# EAGLE design Skematik FC (EAGLE 9.6.2)
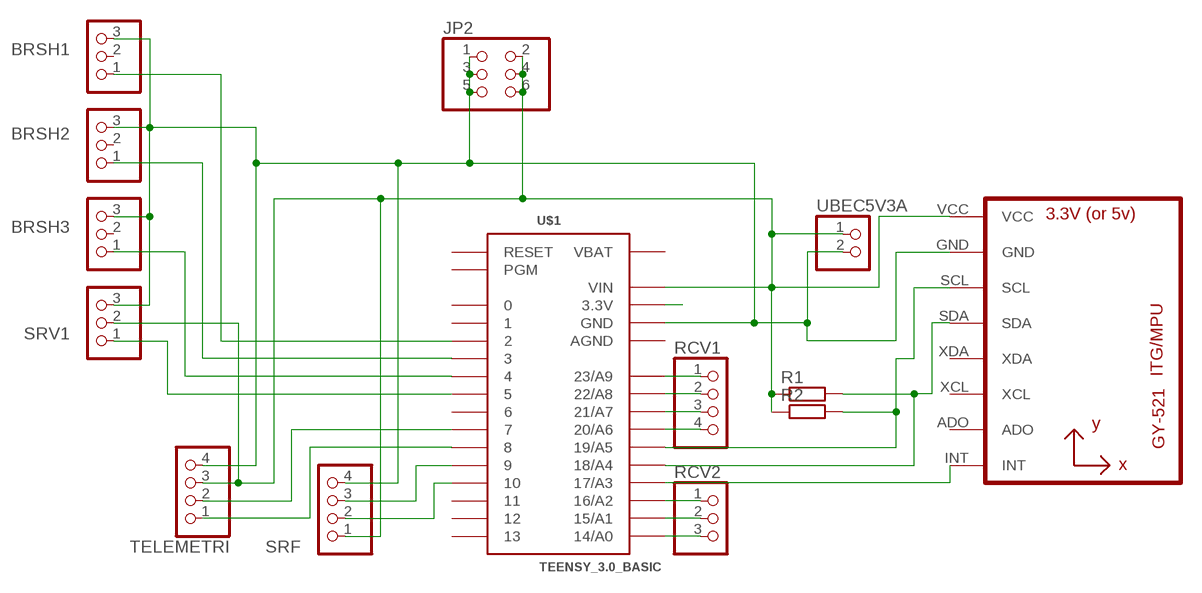
[diagram p0: schematic, sheet 1]

## Parts
BRSH1  PINHD-1X3  [1X03]
BRSH3  PINHD-1X3  [1X03]
BRSHL2  BRSH2  PINHD-1X3  [1X03]
JP2  PINHD-2X3  [2X03]
R1  R-EU_0207/7  [0207/7]
R2  R-EU_0207/7  [0207/7]
RCV1  PINHD-1X4  [1X04]
RCV2  PINHD-1X3  [1X03]
SRF  PINHD-1X4  [1X04]
SRV1  PINHD-1X3  [1X03]
TELEMETRI  PINHD-1X4  [1X04]
U1  GY-521MPU6050  [GY-521]
U$1  TEENSY_3.0_BASIC  [TEENSY_3.0_BASIC]
UBEC5V3A  PINHD-1X2  [1X02]

## Nets
N$1: TELEMETRI.1 U$1.8
N$3: R2.2 U1.SCL U$1.19/A5
N$4: R1.2 U1.SDA U$1.18/A4
N$5: U1.INT U$1.17/A3
N$6: BRSHL2.1 U$1.3
N$7: TELEMETRI.2 U$1.7
N$8: BRSH1.1 U$1.2
N$9: BRSH3.1 U$1.4
N$11: SRV1.1 U$1.5
N$13: RCV1.1 U$1.23/A9
N$14: RCV1.2 U$1.22/A8
N$15: RCV1.3 U$1.21/A7
N$16: RCV1.4 U$1.20/A6
N$17: RCV2.1 U$1.16/A2
N$18: RCV2.2 U$1.15/A1
N$19: RCV2.3 U$1.14/A0
N$20: SRF.3 U$1.9
N$21: SRF.2 U$1.10
N$23: BRSH1.3 BRSH3.3 BRSHL2.3 JP2.1 JP2.3 JP2.5 SRF.4 SRV1.3 TELEMETRI.4 U1.GND U$1.GND U$1.GND1(GND) UBEC5V3A.2
N$24: JP2.2 JP2.4 JP2.6 R1.1 R2.1 SRF.1 SRV1.2 TELEMETRI.3 U1.VCC U$1.VIN UBEC5V3A.1
N$25: U$1.3.3V U$1.3.3V1(3.3V)
Unconnected: BRSH1.2 BRSH3.2 BRSHL2.2 U1.ADO U1.XCL U1.XDA U$1.0 U$1.1 U$1.6 U$1.11 U$1.12 U$1.13 U$1.PGM U$1.RESET

## Power pins joined to a net without a drawn wire
AGND: U$1.AGND
VBAT: U$1.VBAT

## Library data of the parts
BRSH1 BRSH3 BRSHL2 RCV2 SRV1 = pinhead:PINHD-1X3: PIN HEADER
JP2 = pinhead:PINHD-2X3: PIN HEADER
R1 R2 = rcl:R-EU_: RESISTOR, European symbol; SPICEPREFIX: R
RCV1 SRF TELEMETRI = pinhead:PINHD-1X4: PIN HEADER
U1 = gy-521:GY-521
U$1 = Teensy_3_Series_Board_v1.0:TEENSY_3.0_BASIC: Basic Teensy 3.0 with none of the 'inner' pins enabled. See '+4', 'AllAnalogPins", and 'AllPins' packages for additional pin holes, as needed.
UBEC5V3A = pinhead:PINHD-1X2: PIN HEADER

## Board
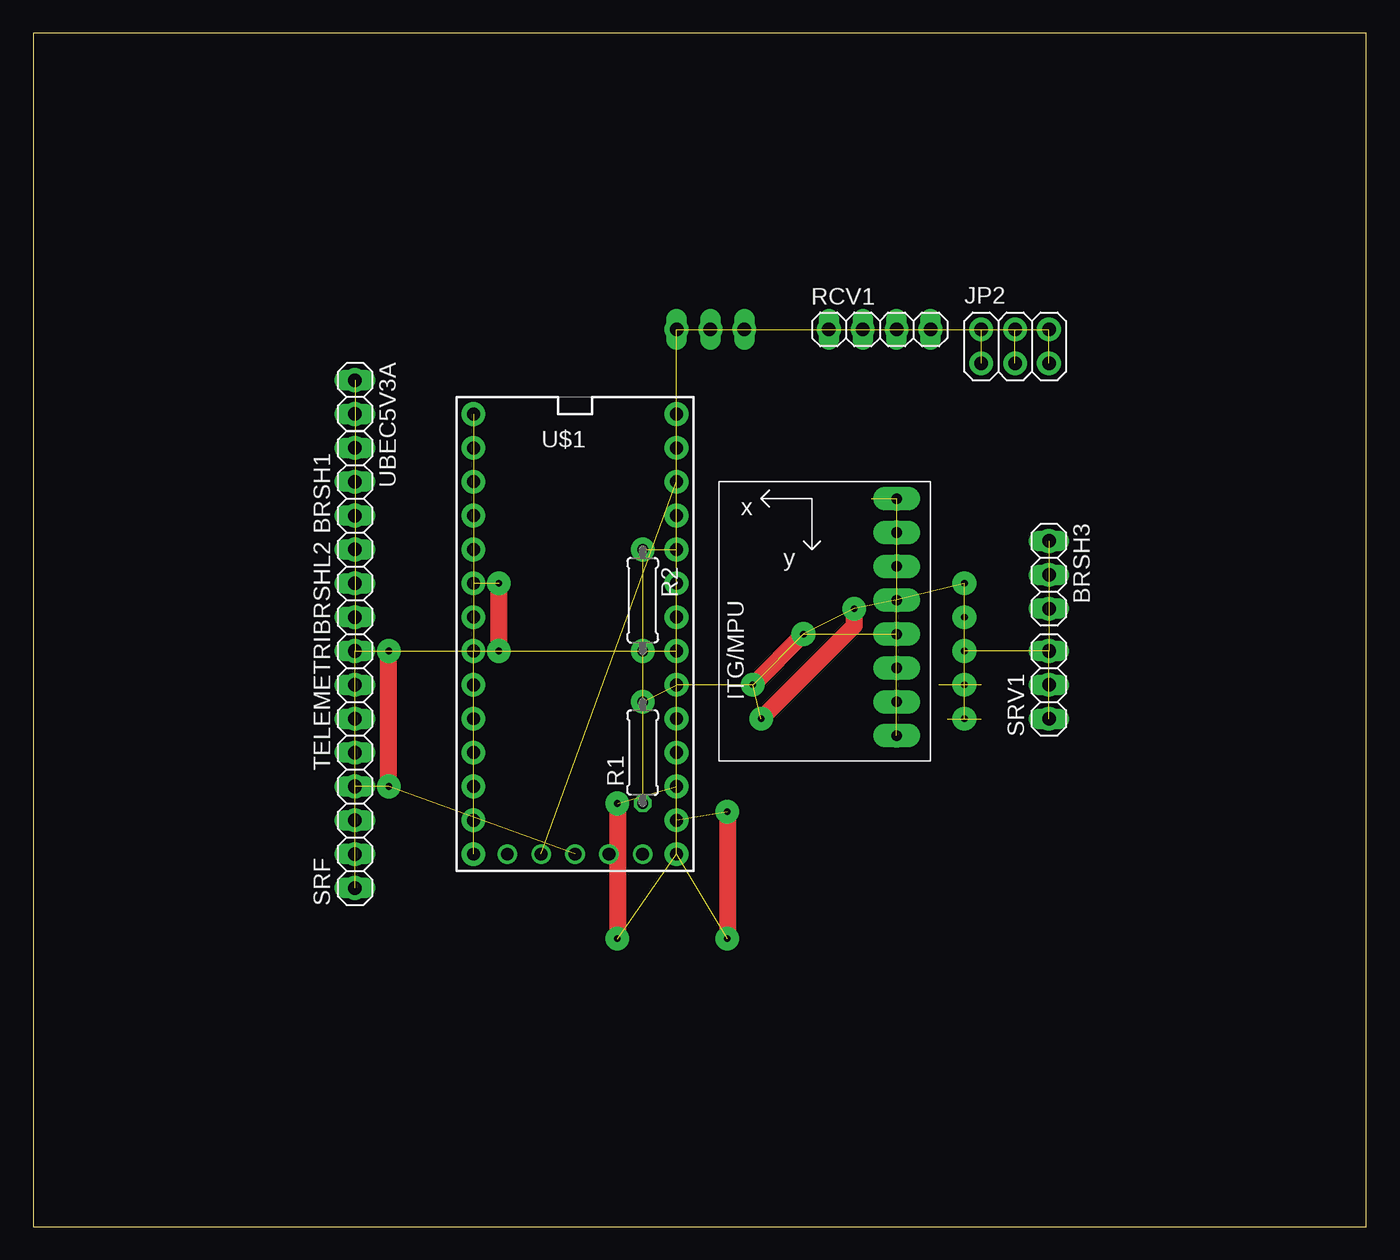
[diagram p1: board, top side]
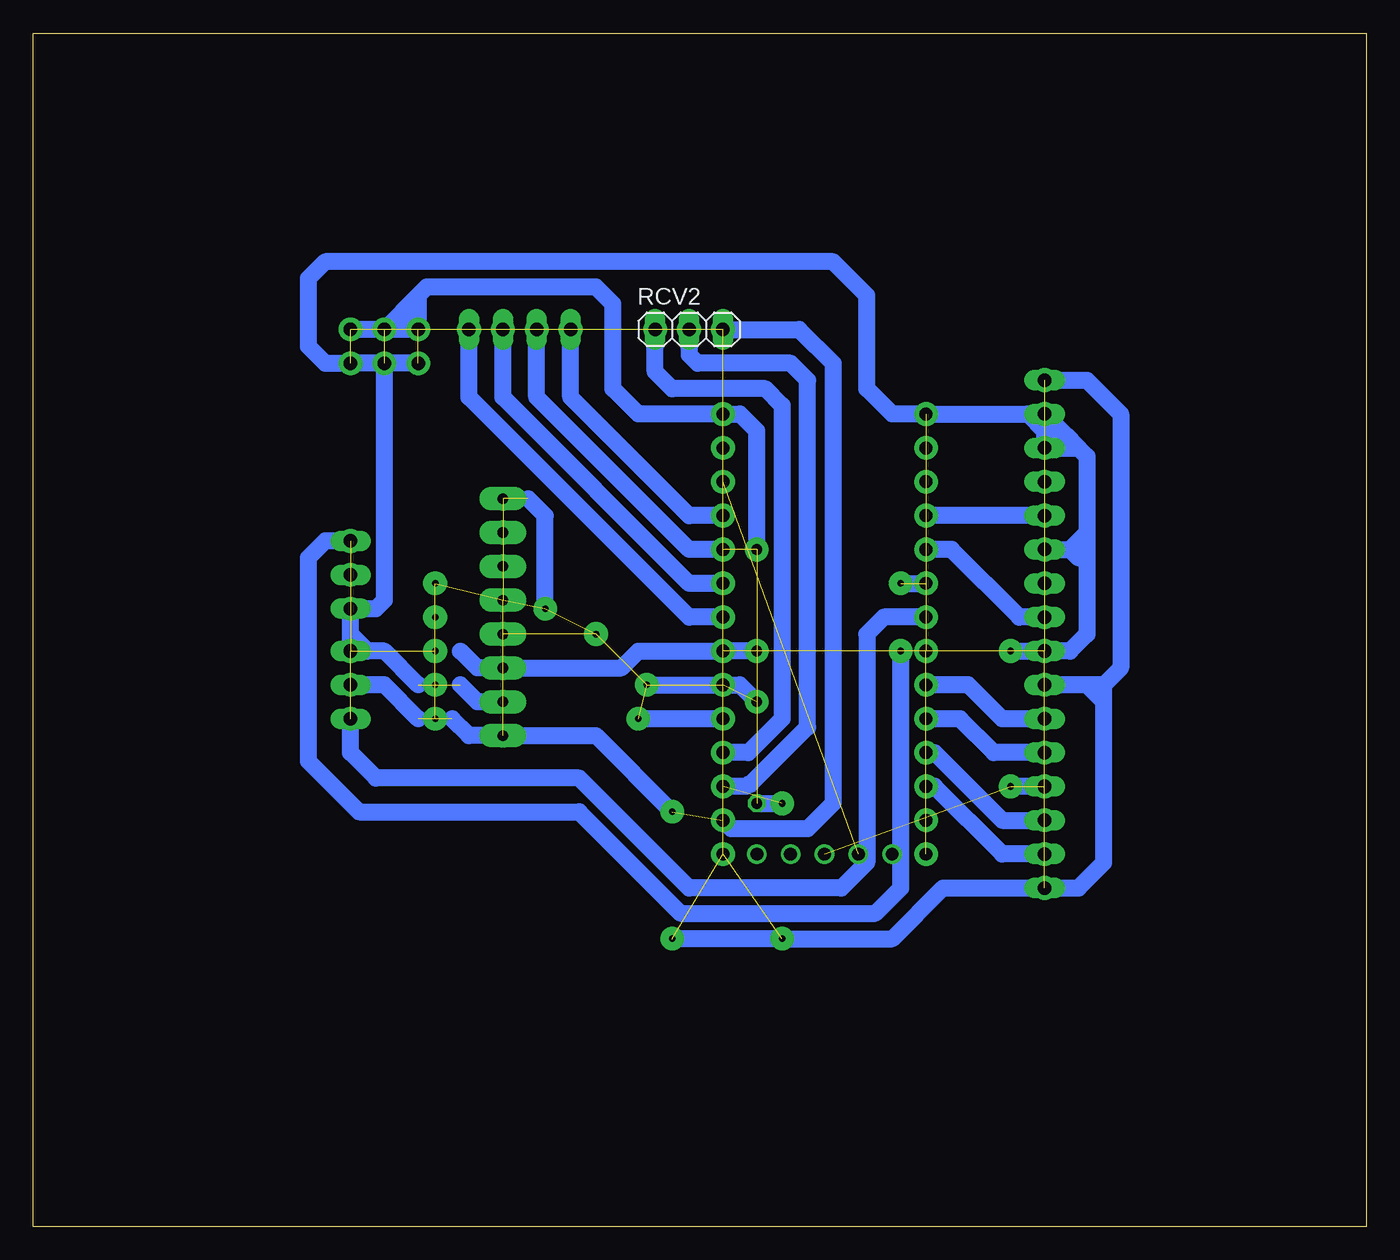
[diagram p2: board, bottom side, seen from below]

Size 100 x 89.53 mm. Coordinates in mm from the lower left corner, seen from the top.
Outline: 0,0 100,0 100,89.53 0,89.53 0,0
Copper layers (1*16): Top 0.035mm / dielectric 1.5mm / Bottom 0.035mm
Design rules "default": minimum track width 6mil, minimum drill 0.35mm, track to track 6mil, track to pad 6mil, pad to pad 6mil, via to via 6mil, smd to smd 6mil, copper to edge 40mil, drill to drill 6mil, minimum pad ring 10mil, minimum via ring 8mil, stop-mask expansion 4mil, vias tented up to drill 0mil, thermal gap 10mil

### Footprints (pad centres in the part's own frame; a part is rotated, then mirrored left to right if it is on the bottom)
1X03 = drill 1.016 long: 1 -2.54,0; 2 0,0; 3 2.54,0
2X03 = drill 1.016 octagon: 1 -2.54,-1.27; 2 -2.54,1.27; 3 0,-1.27; 4 0,1.27; 5 2.54,-1.27; 6 2.54,1.27
0207/7 = drill 0.813 octagon: 1 -3.81,0; 2 3.81,0
1X04 = drill 1.016 long: 1 -3.81,0; 2 -1.27,0; 3 1.27,0; 4 3.81,0
GY-521 = drill 0.8 pad 1.778 long: ADO -8.89,-6.35; GND -8.89,6.35; INT -8.89,-8.89; SCL -8.89,3.81; SDA -8.89,1.27; VCC -8.89,8.89; XCL -8.89,-3.81; XDA -8.89,-1.27
TEENSY_3.0_BASIC = drill 0.965: 0 -7.62,13.97; 1 -7.62,11.43; 2 -7.62,8.89; 3 -7.62,6.35; 3.3V 7.62,11.43; 3.3V1 -2.54,-16.51; 4 -7.62,3.81; 5 -7.62,1.27; 6 -7.62,-1.27; 7 -7.62,-3.81; 8 -7.62,-6.35; 9 -7.62,-8.89; 10 -7.62,-11.43; 11 -7.62,-13.97; 12 -7.62,-16.51; 13 7.62,-16.51; 14/A0 7.62,-13.97; 15/A1 7.62,-11.43; 16/A2 7.62,-8.89; 17/A3 7.62,-6.35; 18/A4 7.62,-3.81; 19/A5 7.62,-1.27; 20/A6 7.62,1.27; 21/A7 7.62,3.81; 22/A8 7.62,6.35; 23/A9 7.62,8.89; AGND 7.62,13.97; GND -7.62,16.51; GND1 0,-16.51; PGM 2.54,-16.51; RESET 5.08,-16.51; VBAT -5.08,-16.51; VIN 7.62,16.51
1X02 = drill 1.016 long: 1 -1.27,0; 2 1.27,0

### Placement (x,y rotation side)
BRSH1  24.13,55.88 90 top
BRSH3  76.2,48.9 270 top
BRSHL2  24.13,48.26 90 top
JP2  73.66,66.04 0 top
R1  45.72,35.56 90 top
R2  45.72,46.99 270 top
RCV1  63.5,67.31 0 top
RCV2  50.8,67.31 0 bottom
SRF  24.13,29.21 90 top
SRV1  76.2,40.64 90 top
TELEMETRI  24.13,39.37 90 top
U1  55.88,45.72 180 top
U$1  40.64,44.45 0 top
UBEC5V3A  24.13,62.23 270 top

### Tracks (layer width: path | path; a pad name or v marks a point on that pad's centre or on a via)
N$1
  Bottom 1.27: TELEMETRI.1 27.94,35.56 30.48,38.1 U$1.8
N$2  (via drill 0.5 pad 1.78)  (90 unrouted)
  other vias: 33.02,60.96 33.02,58.42 33.02,55.88 33.02,53.34 33.02,50.8 33.02,48.26 34.92,48.26 33.02,45.72 33.02,45.72 33.02,43.18 33.02,43.18 33.02,40.64 33.02,38.1 33.02,35.56 33.02,33.02 33.02,30.48 33.02,30.48 33.02,27.94 33.02,27.94 48.26,27.94 48.26,27.94 48.26,30.48 48.26,33.02 48.26,35.56 48.26,38.1 48.26,40.64 48.26,43.18 48.26,45.72 48.26,45.72 48.26,48.26 48.26,50.8 48.26,53.34 48.26,55.88 48.26,55.88 48.26,58.42 48.26,58.42 48.26,60.96 34.92,43.18 43.81,31.75 26.67,43.18 26.67,33.02 43.81,21.59 52.07,21.59 52.07,31.11 54.61,38.1 53.98,40.64 57.78,44.45 61.59,46.35 71.12,67.31 73.66,67.31 76.2,67.31 76.2,67.31 76.2,64.77 73.66,64.77 71.12,64.77 45.72,39.37 45.72,43.18 45.72,50.8 24.13,33.02 24.13,35.56 24.13,38.1 24.13,40.64 24.13,43.18 24.13,45.72 24.13,48.26 24.13,50.8 24.13,53.34 24.13,55.88 24.13,58.42 24.13,58.42 24.13,60.96 24.13,63.5 24.13,30.48 24.13,27.94 24.13,25.4 64.77,54.61 64.77,52.07 64.77,52.07 64.77,49.53 64.77,49.53 64.77,46.99 64.77,46.99 64.77,44.45 64.77,41.91 64.77,39.37 64.77,36.83 69.85,38.1 69.85,40.64 69.85,43.18 69.85,45.72 69.85,48.26 69.85,48.26 76.2,51.44 76.2,48.9 76.2,46.35 76.2,43.18 76.2,40.64 76.2,38.1 76.2,38.1 67.31,67.31 64.77,67.31 64.77,67.31 62.23,67.31 59.69,67.31 53.34,67.31 50.8,67.31 48.26,67.31
N$3
  Bottom 1.27: 67.94,43.18 66.67,41.91 U1.SCL 55.88,41.91 54.61,43.18 U$1.19/A5 R2.2
N$4  (via drill 0.35)  (1 unrouted)
  Top 1.27: v57.78,44.45 v53.98,40.64
  Bottom 1.27: U$1.18/A4 46.99,40.64 R1.2 | U$1.18/A4 v53.98,40.64 U$1.18/A4
N$5  (via drill 0.35)  (1 unrouted)
  Top 1.27: v54.61,38.1 61.59,45.09 v61.59,46.35
  Bottom 1.27: U$1.17/A3 v54.61,38.1 | v61.59,46.35 61.59,53.34 62.87,54.61
N$6
  Bottom 1.27: BRSHL2.1 26.04,45.72 31.11,50.8 U$1.3
N$7
  Bottom 1.27: TELEMETRI.2 27.3,38.1 29.84,40.64 U$1.7
N$8
  Bottom 1.27: BRSH1.1 U$1.2
N$9  (via drill 0.35)
  Top 1.27: v34.92,43.18 v34.92,48.26
  Bottom 1.27: BRSH3.1 78.11,51.44 79.38,50.16 79.38,34.92 75.56,31.11 59.05,31.11 51.44,23.5 36.83,23.5 34.92,25.4 v34.92,43.18 | v34.92,48.26 U$1.4
N$11
  Bottom 1.27: U$1.5 36.2,45.72 37.47,44.45 37.47,27.3 39.37,25.4 50.8,25.4 59.05,33.66 74.3,33.66 76.2,35.56 SRV1.1
N$13
  Bottom 1.27: U$1.23/A9 50.8,53.34 59.69,62.23 RCV1.1
N$14
  Bottom 1.27: RCV1.2 62.23,62.23 50.8,50.8 U$1.22/A8
N$15
  Bottom 1.27: RCV1.3 64.77,62.23 50.8,48.26 U$1.21/A7
N$16
  Bottom 1.27: RCV1.4 67.31,62.23 50.8,45.72 U$1.20/A6
N$17
  Bottom 1.27: U$1.16/A2 46.35,35.56 43.81,38.1 43.81,61.59 45.09,62.87 52.07,62.87 53.34,64.14 RCV2.1
N$18
  Bottom 1.27: U$1.15/A1 46.5,33.02 46.32,33.2 46.18,33.2 41.91,37.47 41.91,63.5 43.18,64.77 50.16,64.77 50.8,65.41 RCV2.2
N$19
  Bottom 1.27: U$1.14/A0 47.62,29.84 41.91,29.84 40.01,31.75 40.01,64.77 42.55,67.31 RCV2.3
N$20
  Bottom 1.27: U$1.9 32.38,35.56 27.3,30.48 SRF.3
N$21
  Bottom 1.27: SRF.2 27.3,27.94 32.38,33.02 U$1.10
N$23  (via drill 0.35)  (2 unrouted)
  Top 1.27: v26.67,33.02 v26.67,43.18
  Bottom 1.27: 25.4,60.96 U$1.GND 35.56,60.96 37.47,62.87 37.47,69.85 40.01,72.39 78.11,72.39 79.38,71.12 79.38,66.04 78.11,64.77 JP2.5 JP2.3 | 25.4,60.96 UBEC5V3A.2 | UBEC5V3A.2 24.13,59.69 | 24.13,59.69 BRSH1.3 | BRSH1.3 21.59,58.42 | 20.95,52.07 20.95,57.78 21.59,58.42 | 20.95,52.07 20.95,50.8 | 20.95,50.8 20.95,50.16 | 21.59,58.42 22.54,59.37 | 22.54,59.37 UBEC5V3A.2 | BRSH1.3 23.18,59.37 22.54,59.37 | 24.13,59.69 25.4,60.96 | BRSHL2.3 22.23,50.8 | 22.23,50.8 20.95,50.8 | 20.95,52.07 22.23,50.8 | 22.23,50.8 21.59,50.16 20.95,50.16 | 20.95,50.16 20.95,44.45 22.23,43.18 TELEMETRI.4 v26.67,43.18 | U1.GND 66.67,39.37 67.94,40.64 | 71.12,40.64 73.66,43.18 74.93,43.18 | JP2.1 JP2.3 | 74.93,43.18 SRV1.3 76.2,44.45 | 76.2,44.45 BRSH3.3 74.3,46.35 73.66,46.99 JP2.3 | 76.2,44.45 74.93,43.18 | SRF.4 v26.67,33.02
N$24  (via drill 0.35)  (2 unrouted)
  Top 1.27: v52.07,31.11 v52.07,21.59 | v43.81,31.75 v43.81,21.59
  Bottom 1.27: UBEC5V3A.1 20.95,63.5 18.41,60.96 18.41,41.91 19.68,40.64 | 19.68,40.64 20.95,40.64 | 20.95,40.64 TELEMETRI.3 | 19.68,39.37 19.68,27.3 21.59,25.4 SRF.1 31.75,25.4 35.56,21.59 v43.81,21.59 v52.07,21.59 | 19.68,39.37 19.68,40.64 | 19.68,39.37 20.95,40.64 | 68.58,38.1 67.31,36.83 U1.VCC 57.78,36.83 v52.07,31.11 | 71.12,38.1 73.66,40.64 SRV1.2 | 72.39,67.31 JP2.2 71.12,68.58 | 72.39,67.31 JP2.4 | JP2.4 JP2.6 | 71.12,69.85 70.48,70.48 57.78,70.48 56.52,69.22 56.52,62.87 54.61,60.96 U$1.VIN 46.99,60.96 45.72,59.69 R2.1 | 71.12,69.85 71.12,68.58 | JP2.4 71.12,69.85 | 72.39,67.31 71.12,68.58 | R1.1 v43.81,31.75
N$25  (1 unrouted)